# EAGLE design Potentiometer ADC (EAGLE 9.5.2)
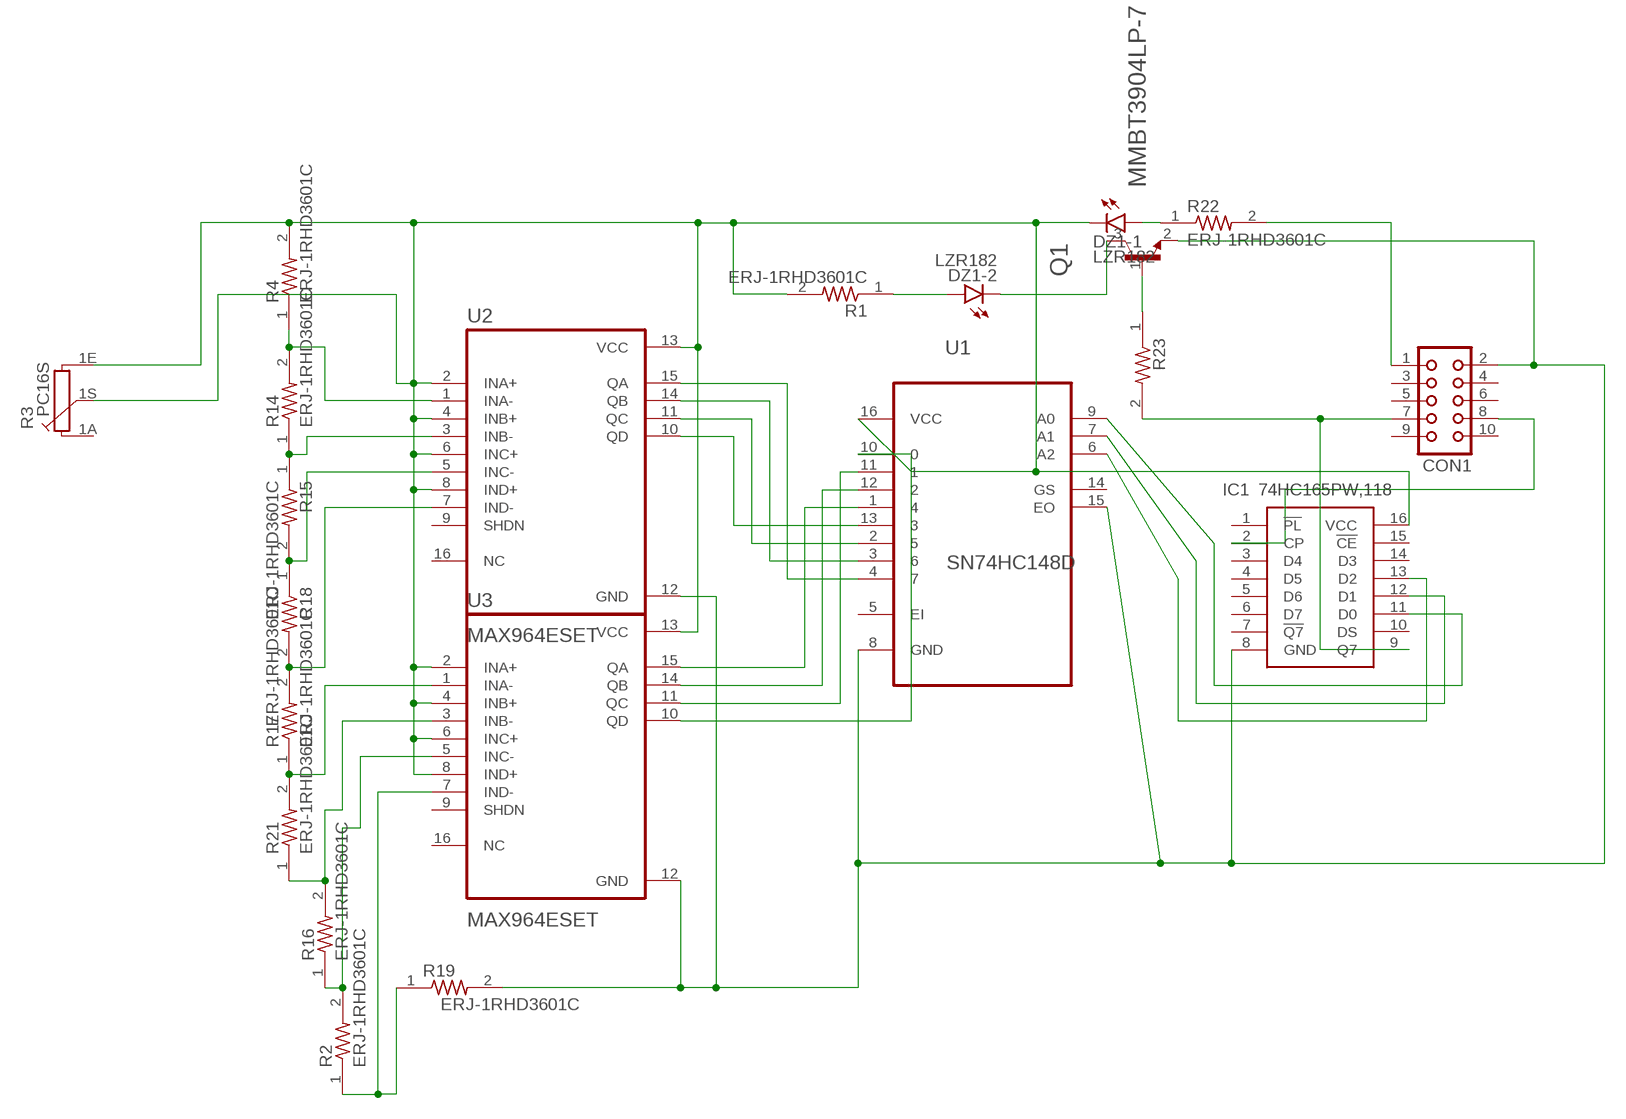
[diagram p0: schematic, sheet 1]

## Parts
CON1  CON10L  [CON10L]
DZ1  LZR182  [LZR182]
IC1  74HC165PW,118  [SOP65P640X110-16N]
Q1  MMBT3904LP-7  [DFN101X61X53-3N]
R1  ERJ-1RHD3601C  [RESC0603X26N]
R2  ERJ-1RHD3601C  [RESC0603X26N]
R3  PC16S  [PC16S]
R4  ERJ-1RHD3601C  [RESC0603X26N]
R14  ERJ-1RHD3601C  [RESC0603X26N]
R15  ERJ-1RHD3601C  [RESC0603X26N]
R16  ERJ-1RHD3601C  [RESC0603X26N]
R17  ERJ-1RHD3601C  [RESC0603X26N]
R18  ERJ-1RHD3601C  [RESC0603X26N]
R19  ERJ-1RHD3601C  [RESC0603X26N]
R21  ERJ-1RHD3601C  [RESC0603X26N]
R22  ERJ-1RHD3601C  [RESC0603X26N]
R23  ERJ-1RHD3601C  [RESC0603X26N]
U1  SN74HC148D  [SOIC127P600X175-16N]
U2  MAX964ESET  [SOIC127P600X175-16N]
U3  MAX964ESET  [SOIC127P600X175-16N]

## Nets
N$1: R2.2 R16.1 U3.5(INC-)
N$2: CON1.1 R22.2
N$3: R4.1 R14.2 U2.1(INA-)
N$4: R14.1 R15.1 U2.3(INB-)
N$6: R15.2 R18.1 U2.5(INC-)
N$7: R17.2 R18.2 U2.7(IND-)
N$8: IC1.11(D0) U1.9(A0)
N$9: R17.1 R21.2 U3.1(INA-)
N$10: R16.2 R21.1 U3.3(INB-)
N$11: R2.1 R19.1 U3.7(IND-)
N$12: CON1.2 IC1.8(GND) Q1.2(E) R19.2 U1.8(GND) U1.15(EO) U2.12(GND) U3.12(GND)
N$13: U1.4 U2.15(QA)
N$14: U1.3 U2.14(QB)
N$15: IC1.12(D1) U1.7(A1)
N$16: IC1.13(D2) U1.6(A2)
N$18: DZ1.A1(-1:A) R22.1
N$19: CON1.7 IC1.9(Q7) R23.2
N$20: Q1.1(B) R23.1
N$21: U1.2 U2.11(QC)
N$22: DZ1.A2(-2:A) R1.1
N$23: U1.13 U2.10(QD)
N$24: DZ1.K2(-2:C) Q1.3(C)
N$25: CON1.8 IC1.2(CP)
N$26: U1.1 U3.15(QA)
N$27: U1.12 U3.14(QB)
N$28: U1.11 U3.11(QC)
N$29: U1.10 U3.10(QD)
N$30: DZ1.K1(-1:C) IC1.16(VCC) R1.2 R3.1E R3.1S R4.2 U1.16(VCC) U2.2(INA+) U2.4(INB+) U2.6(INC+) U2.8(IND+) U2.13(VCC) U3.2(INA+) U3.4(INB+) U3.6(INC+) U3.8(IND+) U3.13(VCC)
Unconnected: CON1.3 CON1.4 CON1.5 CON1.6 CON1.9 CON1.10 IC1.1(!PL) IC1.3(D4) IC1.4(D5) IC1.5(D6) IC1.6(D7) IC1.7(!Q7) IC1.10(DS) IC1.14(D3) IC1.15(!CE) R3.1A U1.5(EI) U1.14(GS) U2.9(SHDN) U2.16(NC) U3.9(SHDN) U3.16(NC)

## Library data of the parts
CON1 = con-harting:CON10L: CONNECTOR; OC_FARNELL: unknown; OC_NEWARK: unknown
DZ1 = led:LZR182: LED BLOCK 2 LEDs, Siemens
IC1 = 74HC165PW_118:74HC165PW,118: 74HC(T)165 - 8-bit parallel-in/serial-out shift register@en-us Source: Datasheet <https://assets.nexperia.com/documents/data-sheet/74HC_HCT165.pdf>; DESCRIPTION: 74HC(T)165 - 8-bit parallel-in/serial-out shift register@en-us; HEIGHT: 1.1mm; MANUFACTURER_NAME: Nexperia; MANUFACTURER_PART_NUMBER: 74HC165PW,118; MOUSER_PART_NUMBER: 771-74HC165PW-T; MOUSER_PRICE-STOCK: https://www.mouser.com/Search/Refine.aspx?Keyword=771-74HC165PW-T
Q1 = MMBT3904LP-7:MMBT3904LP-7: MMBT3904LP Series 40 V 200 mA NPN Surface Mount Transistor - DFN1006-3; DESCRIPTION: Bipolar _BJT_ Transistor NPN 40V 200mA 300MHz 250mW Surface Mount 3-DFN1006 _1.0x0.6_; DIGI-KEY_PART_NUMBER: MMBT3904LP-7DICT-ND; DIGI-KEY_PURCHASE_URL: https://www.digikey.com/product-detail/en/diodes-incorporated/MMBT3904LP-7/MMBT3904LP-7DICT-ND/8283872?utm_source=snapeda&utm_medium=aggregator&utm_campaign=symbol; MF: Diodes Inc.; MP: MMBT3904LP-7; PACKAGE: DFN-3 Diodes Inc.
R1 R2 R4 R14-R19 R21-R23 = Resistor:ERJ-1RHD3601C: 0201 chip resistor 0201 SMD resistor 3600ohm 0.5%; AVAILABILITY: Unavailable; DESCRIPTION: 0201 chip resistor 0201 SMD resistor 3600ohm 0.5%; MF: Panasonic; MP: ERJ-1RHD3601C; PACKAGE: 0201 Panasonic; PRICE: None
R3 = piher:PC16S: POTENTIOMETER single carbon potentiometer, 16 mm, S3ROH; OC_FARNELL: 4452940; OC_NEWARK: unknown
U1 = SN74HC148D:SN74HC148D: 8:3 line Priority Encoder; AVAILABILITY: Unavailable; DESCRIPTION: IC 8-TO-3 PRIORITY ENCOD 16-SOIC; MF: Texas Instruments; MP: SN74HC148D; PACKAGE: SOIC-16 Texas Instruments; PRICE: None
U2 U3 = MAX964ESET:MAX964ESET; AVAILABILITY: Unavailable; DESCRIPTION: Linear IC - Comparator Maxim Integrated MAX964ESE+ Multi-purpose CMOS, TTL SOIC 16; MF: Maxim Integrated; MP: MAX964ESE+; PACKAGE: SOIC-16 Maxim; PRICE: None

## Board
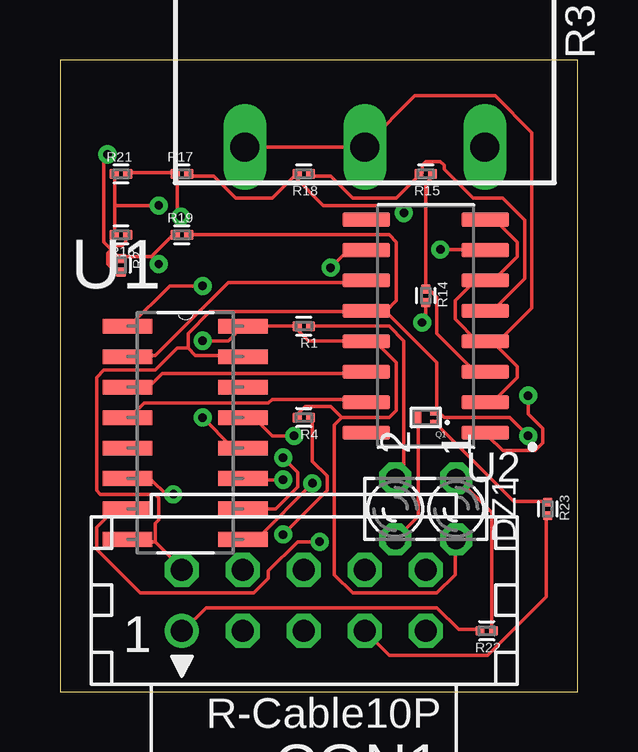
[diagram p1: board, top side]
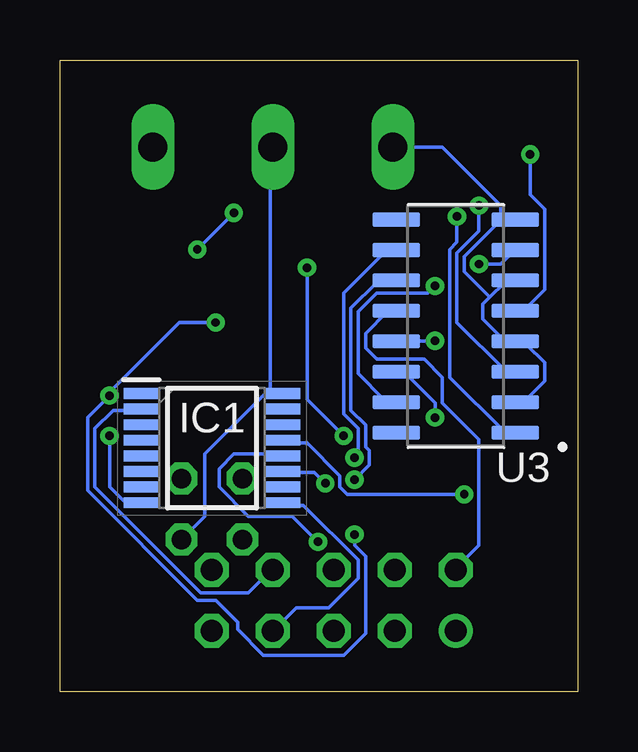
[diagram p2: board, bottom side, seen from below]

Size 21.57 x 26.34 mm. Coordinates in mm from the lower left corner, seen from the top.
Outline: 0,0 21.57,0 21.57,26.34 0,26.34 0,0
Copper layers (1*16): Top 0.035mm / dielectric 1.5mm / Bottom 0.035mm
Design rules "default": minimum track width 6mil, minimum drill 0.35mm, track to track 6mil, track to pad 6mil, pad to pad 6mil, via to via 6mil, smd to smd 6mil, copper to edge 40mil, drill to drill 6mil, minimum pad ring 10mil, minimum via ring 8mil, stop-mask expansion 4mil, vias tented up to drill 0mil, thermal gap 10mil

### Footprints (pad centres in the part's own frame; a part is rotated, then mirrored left to right if it is on the bottom)
CON10L = drill 0.914: 1 5.08,1.27 | drill 0.914 octagon: 2 5.08,-1.27; 3 2.54,1.27; 4 2.54,-1.27; 5 0,1.27; 6 0,-1.27; 7 -2.54,1.27; 8 -2.54,-1.27; 9 -5.08,1.27; 10 -5.08,-1.27
LZR182 = drill 0.813 octagon: A1 -1.27,1.27; A2 -1.27,-1.27; K1 1.27,1.27; K2 1.27,-1.27
SOP65P640X110-16N = smd 1.475 x 0.45: 1 -2.938,2.275; 2 -2.938,1.625; 3 -2.938,0.975; 4 -2.938,0.325; 5 -2.938,-0.325; 6 -2.938,-0.975; 7 -2.938,-1.625; 8 -2.938,-2.275; 9 2.938,-2.275; 10 2.938,-1.625; 11 2.938,-0.975; 12 2.938,-0.325; 13 2.938,0.325; 14 2.938,0.975; 15 2.938,1.625; 16 2.938,2.275
DFN101X61X53-3N = smd 0.28 x 0.17: 1 -0.325,0.175; 2 -0.325,-0.175 | smd 0.28 x 0.52: 3 0.325,0
RESC0603X26N = smd 0.38 x 0.4: 1 -0.28,0; 2 0.28,0
PC16S = drill 1.2 long: 1A -5,6.5; 1E 5,6.5; 1S 0,6.5
SOIC127P600X175-16N = smd 2.057 x 0.61: 1 -4.801,8.89; 2 -4.801,7.62; 3 -4.801,6.35; 4 -4.801,5.08; 5 -4.801,3.81; 6 -4.801,2.54; 7 -4.801,1.27; 8 -4.801,0; 9 0,0; 10 0,1.27; 11 0,2.54; 12 0,3.81; 13 0,5.08; 14 0,6.35; 15 0,7.62; 16 0,8.89
SOIC127P600X175-16N' = smd 1.97 x 0.59: 1 -2.475,4.445; 2 -2.475,3.175; 3 -2.475,1.905; 4 -2.475,0.635; 5 -2.475,-0.635; 6 -2.475,-1.905; 7 -2.475,-3.175; 8 -2.475,-4.445; 9 2.475,-4.445; 10 2.475,-3.175; 11 2.475,-1.905; 12 2.475,-0.635; 13 2.475,0.635; 14 2.475,1.905; 15 2.475,3.175; 16 2.475,4.445

### Placement (x,y rotation side)
CON1  10.16,3.81 180 top
DZ1  15.24,7.62 270 top
IC1  15.24,10.16 0 bottom
Q1  15.24,11.43 180 top
R1  10.16,15.24 180 top
R2  2.54,17.78 270 top
R3  12.7,29.21 180 top
R4  10.16,11.43 180 top
R14  15.24,16.51 270 top
R15  15.24,21.59 180 top
R16  2.54,19.05 180 top
R17  5.08,21.59 0 top
R18  10.16,21.59 180 top
R19  5.08,19.05 0 top
R21  2.54,21.59 0 top
R22  17.78,2.54 180 top
R23  20.32,7.62 270 top
U1  7.62,6.35 0 top
U2  MAX964ESET  [SOIC127P600X175-16N']  15.24,15.24 180 top
U3  MAX964ESET  [SOIC127P600X175-16N']  5.08,15.24 180 bottom

### Tracks (layer width: path | path; a pad name or v marks a point on that pad's centre or on a via)
N$1  (via drill 0.35)
  Top 0.152: 2.13,18.44 2.29,18.59 2.59,18.59 2.74,18.75 2.74,19.05 R16.1 | 2.13,18.44 1.98,18.29 1.98,17.83 2.29,17.53 2.44,17.53 R2.2 | 2.13,18.44 1.83,18.75 1.83,22.25 v1.98,22.4
  Bottom 0.152: v1.98,22.4 1.98,20.73 1.37,20.12 1.37,16.76 2.13,16 2.59,16 U3.5
N$2
  Top 0.152: R22.2 17.37,2.59 16.61,2.59 15.7,3.5 6.1,3.5 5.18,2.59 CON1.1
N$3  (via drill 0.35)
  Top 0.152: v9.3,6.55 11.12,8.38 11.12,8.99 10.52,9.6 10.52,11.43 R4.1 | v19.51,12.34 19.51,11.58 20.12,10.97 20.12,10.36 19.81,10.06 18.44,10.06 17.83,10.67 U2.1 | R14.2 15.24,15.54 v15.09,15.39
  Bottom 0.152: v9.3,6.55 9.3,6.1 8.84,5.64 8.84,2.44 9.75,1.52 13.11,1.52 14.17,2.59 14.17,2.9 15.09,3.81 15.85,3.81 20.42,8.38 20.42,11.43 v19.51,12.34 19.51,12.5 16.61,15.39 v15.09,15.39
N$4
  Top 0.152: 15.24,16.92 15.24,21.18 15.54,21.49 R15.1 | 15.24,16.92 15.7,16.46 15.7,14.94 17.22,13.41 17.68,13.41 U2.3 | 15.24,16.92 R14.1
N$6
  Top 0.152: R18.1 10.52,21.49 11.28,21.49 12.19,20.57 14.02,20.57 14.94,21.49 R15.2 15.09,21.64 15.09,21.95 15.24,22.1 15.85,22.1 16,21.95 16,21.79 17.22,20.57 18.44,20.57 19.36,19.66 19.36,17.22 18.14,16 17.83,16 U2.5
N$7  (via drill 0.35)
  Top 0.152: 9.75,21.49 8.84,20.57 7.32,20.57 6.4,21.49 5.49,21.49 R17.2 | v15.85,18.44 17.68,18.44 U2.7 | v14.33,19.96 14.02,20.27 10.97,20.27 9.75,21.49 | 9.75,21.49 R18.2
  Bottom 0.152: v14.33,19.96 v15.85,18.44
N$8  (via drill 0.35)
  Top 0.152: v10.52,8.69 8.23,6.4 7.62,6.4 U1.9
  Bottom 0.152: v10.52,8.69 10.97,9.14 12.19,9.14 IC1.11
N$9  (via drill 0.35)
  Top 0.152: R21.2 2.9,21.64 4.72,21.64 R17.1 4.88,21.49 4.88,19.96 v5.03,19.81
  Bottom 0.152: v5.03,19.81 5.03,18.75 5.33,18.44 5.33,13.11 3.05,10.82 2.74,10.82 U3.1
N$10  (via drill 0.35)
  Top 0.152: 2.29,20.27 2.29,21.49 R21.1 | 2.29,20.27 2.29,19.05 R16.2 | v4.12,20.27 2.29,20.27
  Bottom 0.152: v4.12,20.27 4.12,19.2 5.03,18.29 5.03,15.39 3.05,13.41 2.74,13.41 U3.3
N$11  (via drill 0.35)
  Top 0.152: 3.81,18.14 2.59,18.14 R2.1 | 3.81,18.14 4.72,19.05 R19.1 | v4.12,17.83 3.81,18.14
  Bottom 0.152: v4.12,17.83 3.2,17.83 2.74,18.29 U3.7
N$12  (via drill 0.35)
  Top 0.152: 3.96,6.25 2.9,6.25 U1.8 | 3.96,6.25 5.03,5.18 CON1.2 | 15.7,11.73 15.7,13.72 13.56,15.85 | 15.7,11.73 15.7,11.58 Q1.2 | 13.56,15.85 12.8,15.85 U2.12 | R19.2 13.72,19.05 14.02,18.75 14.02,16.31 13.56,15.85 | 13.56,15.85 U2.12 | v19.51,10.67 18.75,11.43 16,11.43 15.7,11.73 | 5.33,14.33 5.64,14.02 7.62,14.02 U1.15 | 5.33,14.33 5.33,14.94 6.25,15.85 12.65,15.85 U2.12 | 3.96,6.25 3.96,7.01 4.12,7.16 4.12,8.08 3.96,8.23 1.68,8.23 1.52,8.38 1.52,13.11 1.83,13.41 3.96,13.41 4.88,14.33 5.33,14.33
  Bottom 0.152: U3.12 7.62,15.85 7.92,15.85 8.84,14.94 8.84,14.33 8.38,13.87 6.4,13.87 5.64,13.11 5.64,12.04 4.12,10.52 4.12,6.1 5.03,5.18 CON1.2 | v19.51,10.67 19.51,8.53 18.9,7.92 18.29,7.92 IC1.8
N$13
  Top 0.152: U2.15 12.65,12.19 8.84,12.19 8.69,12.04 3.5,12.04 2.9,11.43 U1.4
N$14
  Top 0.152: U2.14 12.65,13.26 4.27,13.26 3.81,12.8 2.9,12.8 U1.3
N$15  (via drill 0.35)
  Top 0.152: v10.82,6.25 9.91,6.25 8.69,5.03 8.69,4.72 8.08,4.12 3.35,4.12 1.52,5.94 1.52,6.86 2.29,7.62 U1.7
  Bottom 0.152: v10.82,6.25 11.89,7.32 13.72,7.32 14.94,8.53 14.94,9.3 14.33,9.91 12.34,9.91 IC1.12
N$16  (via drill 0.35)
  Top 0.152: v4.72,8.23 4.42,8.23 3.81,8.84 2.9,8.84 U1.6
  Bottom 0.152: v4.72,8.23 9.6,8.23 9.91,8.53 9.91,8.99 11.28,10.36 12.19,10.36 IC1.13
N$18
  Top 0.152: R22.1 17.98,2.59 17.98,7.47 16.61,8.84 DZ1.A1
N$19
  Top 0.152: CON1.7 13.72,1.52 17.83,1.52 20.27,3.96 20.27,7.32 R23.2
  Bottom 0.152: CON1.7 11.73,3.5 10.36,3.5 9.14,4.72 9.14,5.49 11.43,7.77 12.19,7.77 IC1.9
N$20
  Top 0.152: Q1.1 15.54,11.28 18.9,7.92 20.27,7.92 R23.1
N$21
  Top 0.152: U2.11 12.65,17.07 7.01,17.07 3.96,14.02 2.9,14.02 U1.2
N$22
  Top 0.152: R1.1 13.72,15.24 14.33,14.63 14.33,9.3 14.02,8.99 DZ1.A2
N$23  (via drill 0.35)
  Top 0.152: v11.28,17.68 11.89,18.29 12.65,18.29 U2.10 | v9.75,10.67 8.84,10.67 8.08,11.43 U1.13
  Bottom 0.152: v11.28,17.68 11.28,12.19 v9.75,10.67
N$24
  Top 0.152: DZ1.K2 14.94,7.32 14.94,11.43 Q1.3
N$25
  Bottom 0.152: IC1.2 18.29,11.73 19.36,11.73 20.12,10.97 20.12,8.53 15.7,4.12 13.72,4.12 12.8,5.03 CON1.8
N$26  (via drill 0.35)
  Top 0.152: v5.94,16.92 4.57,16.92 2.9,15.24 U1.1
  Bottom 0.152: v5.94,16.92 6.25,16.61 8.38,16.61 9.14,15.85 9.14,13.26 8.08,12.19 7.62,12.19 U3.15
N$27  (via drill 0.35)
  Top 0.152: v5.94,11.43 7.16,10.21 7.62,10.21 U1.12
  Bottom 0.152: v5.94,11.43 5.94,12.04 7.16,13.26 7.47,13.26 U3.14
N$28  (via drill 0.35)
  Top 0.152: v9.3,8.84 7.62,8.84 U1.11
  Bottom 0.152: v9.3,8.84 8.69,9.45 8.69,10.06 8.84,10.21 8.84,11.12 9.45,11.73 9.45,16 8.38,17.07 7.62,17.07 U3.11
N$29  (via drill 0.35)
  Top 0.152: v9.3,9.75 9.91,9.14 9.91,8.53 8.99,7.62 U1.10
  Bottom 0.152: v9.3,9.75 9.14,9.91 9.14,10.97 9.75,11.58 9.75,16.61 8.08,18.29 7.62,18.29 U3.10
N$30  (via drill 0.35)
  Top 0.152: v5.94,14.63 7.01,14.63 U1.16 R1.2 9.91,15.24 9.91,15.09 10.36,14.63 12.65,14.63 U2.13 12.8,14.48 13.26,14.48 14.02,13.72 14.02,11.73 13.72,11.43 11.73,11.43 | 11.73,11.43 11.28,11.89 10.21,11.89 9.91,11.58 9.91,11.43 R4.2 | 11.73,11.43 11.43,11.12 11.43,4.88 12.19,4.12 15.7,4.12 16.46,4.88 16.46,6.25 DZ1.K1 | 18.14,14.48 19.05,13.56 19.05,13.11 18.14,12.19 17.83,12.19 U2.2 | 18.14,14.48 17.83,14.48 U2.4 | U2.8 17.83,19.66 18.14,19.66 19.05,18.75 19.05,18.14 18.14,17.22 17.83,17.22 U2.6 17.68,17.07 17.22,17.07 16.46,16.31 16.46,15.54 17.37,14.63 17.68,14.63 U2.4 | R3.1E 7.77,22.71 12.65,22.71 R3.1S 12.8,22.86 14.78,24.84 18.14,24.84 19.66,23.32 19.66,16 18.14,14.48 | 18.14,14.48 U2.4
  Bottom 0.152: 12.8,12.34 13.11,12.34 15.54,9.91 15.54,7.32 DZ1.K1 | 12.8,12.34 12.34,12.34 IC1.16 12.8,12.34 | v5.94,14.63 7.47,14.63 U3.13 | U3.2 2.59,12.19 2.13,12.19 1.37,12.95 1.37,13.72 2.13,14.48 2.59,14.48 U3.4 2.74,14.63 3.05,14.63 3.96,15.54 3.96,16.15 3.66,16.46 | 3.66,16.46 3.05,17.07 2.74,17.07 U3.6 | 3.2,19.66 2.74,19.66 U3.8 3.2,19.66 | 3.2,19.66 4.72,18.14 4.72,17.53 3.66,16.46 | 3.2,19.66 3.2,20.27 5.64,22.71 7.62,22.71 R3.1E | 12.8,12.34 12.8,22.71 R3.1S